# EAGLE design sum_rev1.4 (EAGLE 7.2.0)
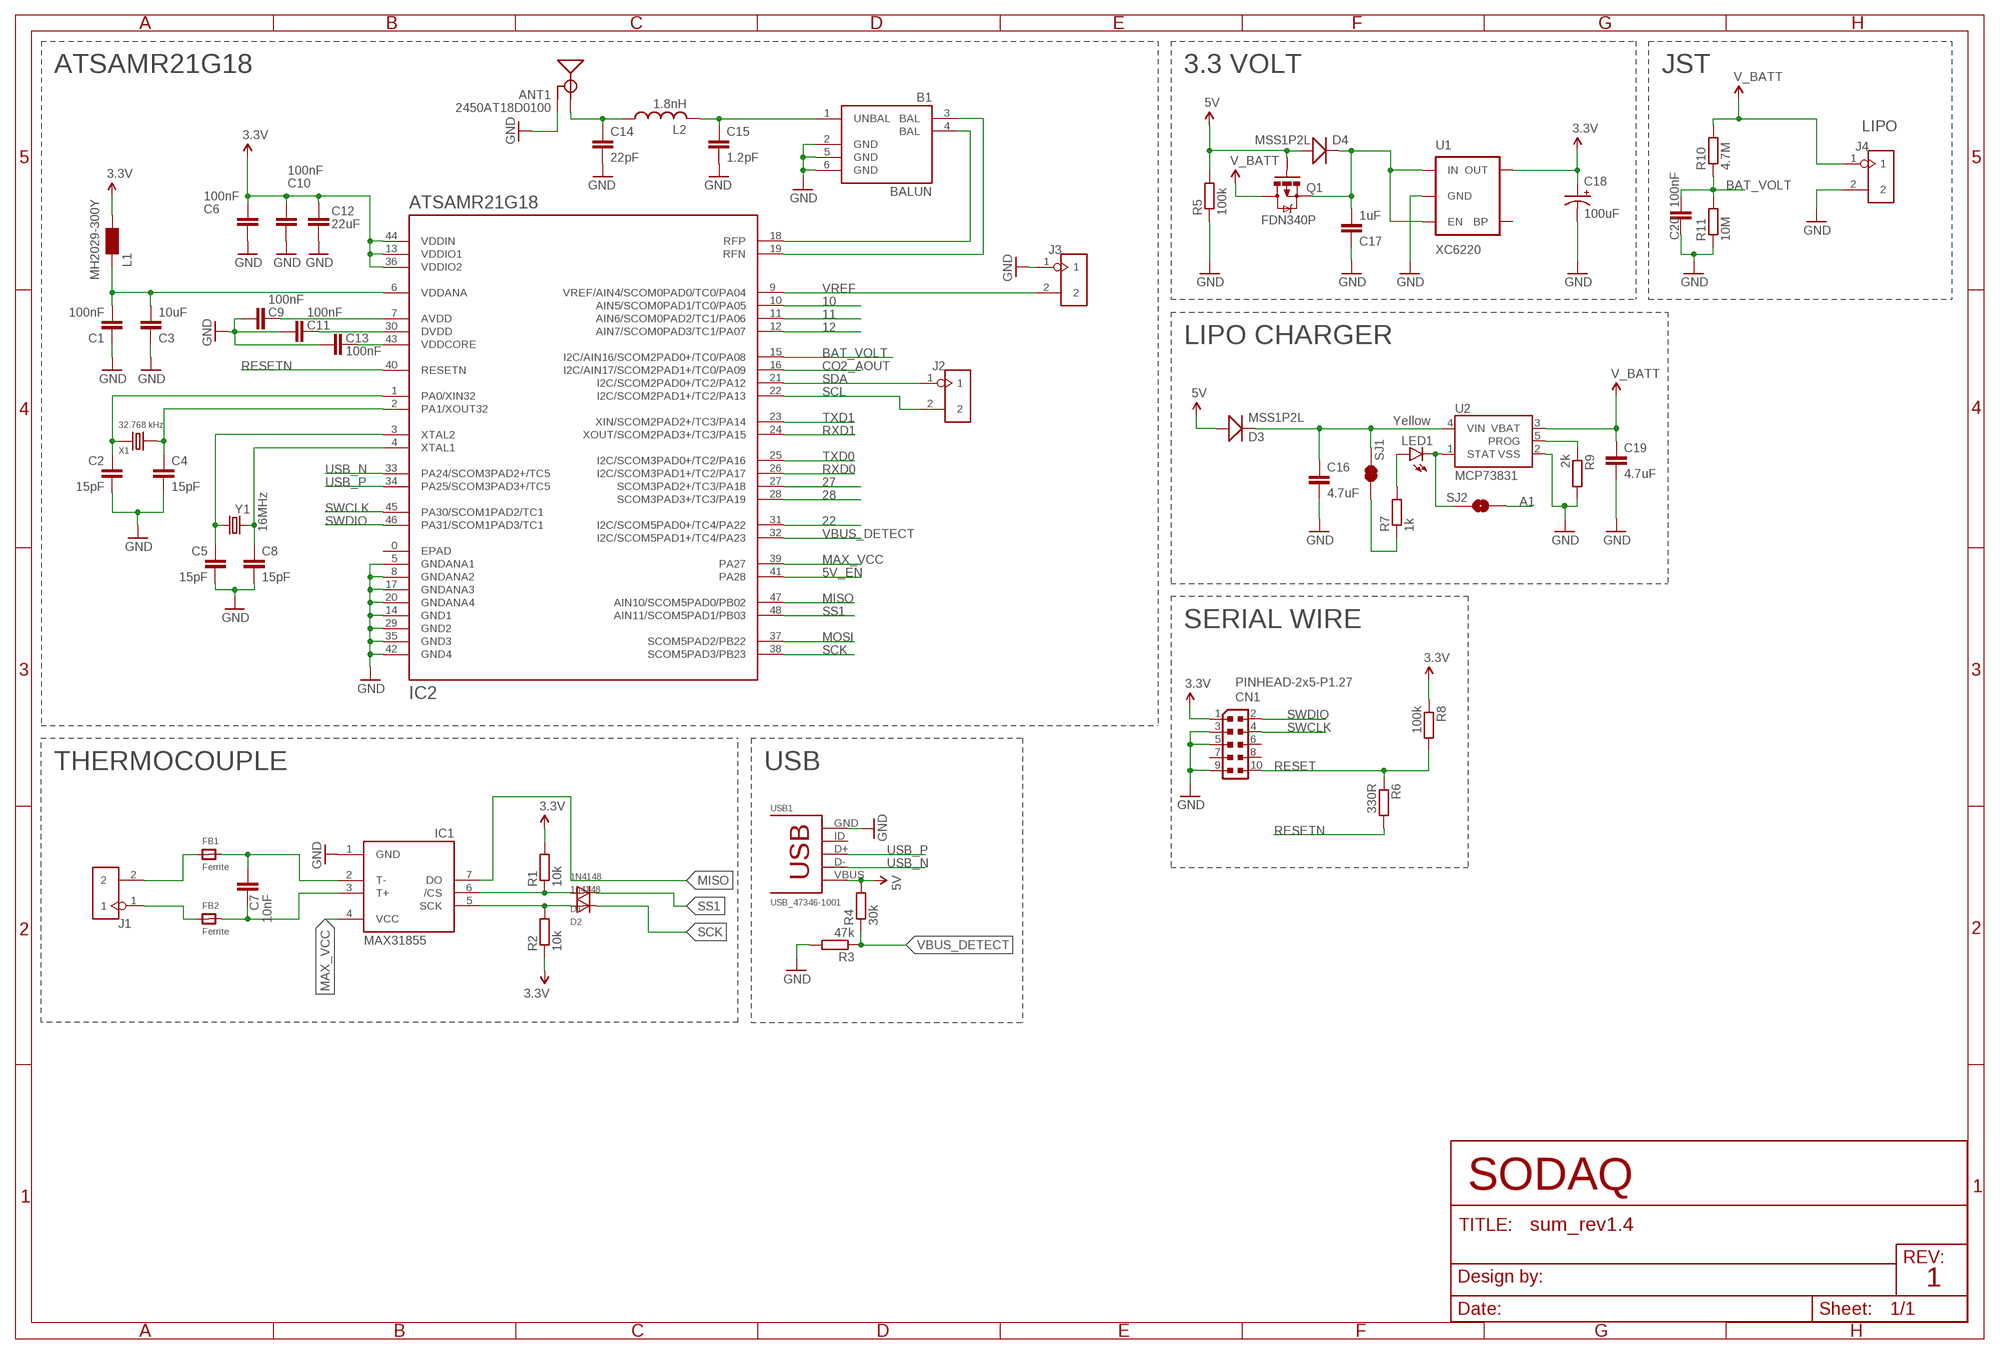
[diagram p0: schematic, sheet 1]

## Parts
ANT1  2450AT18D0100  [2450AT18D0100]
B1  BALUN  [BALUN]
C1  100nF  C_0402  [C0402]
C2  15pF  C_0402  [C0402]
C3  10uF  C_0402  [C0402]
C4  15pF  C_0402  [C0402]
C5  15pF  C_0402  [C0402]
C6  100nF  C_0402  [C0402]
C7  10nF  C_0402  [C0402]
C8  15pF  C_0402  [C0402]
C9  100nF  C_0402  [C0402]
C10  100nF  C_0402  [C0402]
C11  100nF  C_0402  [C0402]
C12  22uF  CAP0805  [0805]
C13  100nF  C_0402  [C0402]
C14  22pF  C_0402  [C0402]
C15  1.2pF  C_0402  [C0402]
C16  4.7uF  C_0603  [C0603]
C17  1uF  C_0603  [C0603]
C18  100uF  CAP_POL1206  [EIA3216]
C19  4.7uF  C_0603  [C0603]
C20  100nF  C_0402  [C0402]
CN1  PINHEAD-2x5-P1.27  0171_PH127-205DF055G00AROUND-PADS  [PINHEAD_2X05_127]
D1  1N4148  DIODESOD-323F  [SOD-323F]
D2  1n4148  DIODESOD-323F  [SOD-323F]
D3  MSS1P2L  D'1005'  [D1005]
D4  MSS1P2L  D'1005'  [D1005]
FB1  Ferrite  FERRITE_0805  [_0805]
FB2  Ferrite  FERRITE_0805  [_0805]
IC1  MAX31855  MAX6675  [SO08]
IC2  ATSAMR21G18  [QFN48_SMALL-CPAD]
J1  HEADER-2P-2.0  [2P-2.0]
J2  HEADER-2P-2.0  [2P-2.0]
J3  HEADER-2P-2.0  [2P-2.0]
J4  HEADER-2P-2.0  [2P-2.0]
L1  MH2029-300Y  0001_BLM21PG300SN1D_/_MH2029-300Y  [0805]
L2  1.8nH  L_0402  [L0402]
LED1  Yellow  LED0603  [LED-0603]
Q1  FDN340P  MOSFET-P-CHANNELSMALL  [SOT23-S-PADS]
R1  10k  R_0402  [R0402]
R2  10k  R_0402  [R0402]
R3  47k  R_0402  [R0402]
R4  30k  R_0402  [R0402]
R5  100k  R_0402  [R0402]
R6  330R  R_0402  [R0402]
R7  1k  R_0402  [R0402]
R8  100k  R_0402  [R0402]
R9  2k  R_0402  [R0402]
R10  4.7M  R_0402  [R0402]
R11  10M  R_0402  [R0402]
SJ1  SOLDERJUMPERNC2  [SJ_2S-NOTRACE]
SJ2  SOLDERJUMPERNO  [SJ_2S-NO]
U1  XC6220  V_REG_LDOSMD  [SOT23-5]
U2  MCP73831  [SOT23-5]
USB1  USB_47346-1001  [USB_47346-1001]
X1  32.768 kHz  CRYSTAL-3215  [2P-SMD-3.2X1.5]
Y1  16MHz  CRYSTAL5X3  [CRYSTAL-SMD-5X3]

## Nets
3.3V: C6.2 C10.2 C12.1 C18.A(+) CN1.1 IC2.13(VDDIO1) IC2.36(VDDIO2) IC2.44(VDDIN) L1.2 R1.2 R2.1 R8.1 U1.5(OUT)
5V: D3.+ D4.+ Q1.1(G) R4.2 R5.2 USB1.VBUS
5V_EN: IC2.41(PA28)
10: IC2.10(AIN5/SCOM0PAD1/TC0/PA05)
11: IC2.11(AIN6/SCOM0PAD2/TC1/PA06)
12: IC2.12(AIN7/SCOM0PAD3/TC1/PA07)
22: IC2.31(I2C/SCOM5PAD0+/TC4/PA22)
27: IC2.27(SCOM3PAD2+/TC3/PA18)
28: IC2.28(SCOM3PAD3+/TC3/PA19)
A1: SJ2.1
BAT_VOLT: C20.2 IC2.15(I2C/AIN16/SCOM2PAD0+/TC0/PA08) R10.1 R11.2
CO2_AOUT: IC2.16(I2C/AIN17/SCOM2PAD1+/TC0/PA09)
CS: D1.A IC1.6(/CS) R1.1
GND: ANT1.2(GND) ANT1.3(GND) ANT1.4(GND) B1.2(GND) B1.5(GND) B1.6(GND) C1.2 C2.1 C3.2 C4.2 C5.2 C6.1 C8.2 C9.2 C10.1 C11.2 C12.2 C13.2 C14.2 C15.2 C16.2 C17.1 C18.C(-) C19.2 C20.1 CN1.3 CN1.5 CN1.9 IC1.1(GND) IC2.5(GNDANA1) IC2.8(GNDANA2) IC2.14(GND1) IC2.17(GNDANA3) IC2.20(GNDANA4) IC2.29(GND2) IC2.35(GND3) IC2.42(GND4) J3.1 J4.2 R3.2 R5.1 R9.2 R11.1 U1.2(GND) U2.2(VSS) USB1.GND
LIPO_STAT: LED1.C SJ2.2 U2.1(STAT)
MAX_VCC: IC1.4(VCC) IC2.39(PA27)
MISO: IC1.7(DO) IC2.47(AIN10/SCOM5PAD0/PB02)
MOSI: IC2.37(SCOM5PAD2/PB22)
N$3: ANT1.1(SIGNAL) C14.1 L2.1
N$4: FB1.1 J1.2
N$5: C7.2 FB1.2 IC1.2(T-)
N$6: C13.1 IC2.43(VDDCORE)
N$7: B1.1(UNBAL) C15.1 L2.2
N$8: C11.1 IC2.30(DVDD)
N$9: FB2.1 J1.1
N$10: C9.1 IC2.7(AVDD)
N$11: C17.2 D4.- Q1.2(S) U1.1(IN) U1.3(EN)
N$12: C2.2 IC2.1(PA0/XIN32) X1.1
N$13: LED1.A R7.2
N$14: R9.1 U2.5(PROG)
N$15: C16.1 D3.- SJ1.2 U2.4(VIN)
N$16: R7.1 SJ1.1
N$17: C4.1 IC2.2(PA1/XOUT32) X1.2
N$18: C1.1 C3.1 IC2.6(VDDANA) L1.1
N$19: C5.1 IC2.3(XTAL2) Y1.1
N$20: C8.1 IC2.4(XTAL1) Y1.3
N$21: B1.4(BAL) IC2.18(RFP)
N$22: B1.3(BAL) IC2.19(RFN)
N$23: C7.1 FB2.2 IC1.3(T+)
RESET: CN1.10 R6.1 R8.2
RESETN: IC2.40(RESETN) R6.2
RXD0: IC2.26(I2C/SCOM3PAD1+/TC2/PA17)
RXD1: IC2.24(XOUT/SCOM2PAD3+/TC3/PA15)
SCK: D2.C IC2.38(SCOM5PAD3/PB23)
SCK1: D2.A IC1.5(SCK) R2.2
SCL: IC2.22(I2C/SCOM2PAD1+/TC2/PA13) J2.2
SDA: IC2.21(I2C/SCOM2PAD0+/TC2/PA12) J2.1
SS1: D1.C IC2.48(AIN11/SCOM5PAD1/PB03)
SWCLK: CN1.4 IC2.45(PA30/SCOM1PAD2/TC1)
SWDIO: CN1.2 IC2.46(PA31/SCOM1PAD3/TC1)
TXD0: IC2.25(I2C/SCOM3PAD0+/TC2/PA16)
TXD1: IC2.23(XIN/SCOM2PAD2+/TC3/PA14)
USB_N: IC2.33(PA24/SCOM3PAD2+/TC5) USB1.D-
USB_P: IC2.34(PA25/SCOM3PAD3+/TC5) USB1.D+
V_BATT: C19.1 J4.1 Q1.3(D) R10.2 U2.3(VBAT)
VBUS_DETECT: IC2.32(I2C/SCOM5PAD1+/TC4/PA23) R3.1 R4.1
VREF: IC2.9(VREF/AIN4/SCOM0PAD0/TC0/PA04) J3.2
Unconnected: CN1.6 CN1.7 CN1.8 U1.4(BP) USB1.ID

## Notes on the sheet
- 3.3 VOLT | JST
- ATSAMR21G18
- LIPO
- LIPO CHARGER
- SERIAL WIRE
- THERMOCOUPLE | USB
- SODAQ
- 1

## Power pins joined to a net without a drawn wire
EPAD: IC2.0(EPAD)

## Library data of the parts
ANT1 = gknff:2450AT18D0100
B1 = gknff:BALUN
C1-C11 C13-C17 C19 C20 = gknff:C
C12 = CH_passive:CAP: Capacitor Standard 0603 ceramic capacitor, and 0.1" leaded capacitor.
C18 = SparkFun-Capacitors:CAP_POL: Capacitor Polarized These are standard SMD and PTH capacitors. Normally 10uF, 47uF, and 100uF in electrolytic and tantalum varieties. Always verify the external diameter of the through hole cap, it varies with capacity, voltage, and manufacturer. The EIA devices should be standard.
CN1 = Connettori:0171_PH127-205DF055G00A: 2x5 PASSO 1,27
D1 D2 = adafruit:DIODE: Diode SMADIODE - SMA Surface Mount Package 20V 1A Schottky Diode Digikey: 641-1014-6-ND DO-1N4148 - Through Hole Small Current Diode SOD-123 20V 1 A (.5mV Vf) Schottky Diode - Digikey: MBRX120TPMSCT-ND SOD-323 10V 570mA (.38mV Vf, 3ns) Schottky Diode - Digikey: ZLLS410CT-ND SOD-523 30V 30mA Schottky Diode (RB751S-40TE61) - Digikey: RB751S-40TE61CT-ND SOT23-R/W - SOT23 Package (R = Solder Paste/Reflow Ovens, W = Hand-Soldering) BAT54Film 40V 300mA - Digikey: 497-7162-1-ND
D3 D4 = Seeedstudio_Discrete_2:D*
FB1 FB2 = microbuilder:FERRITE: Ferrite Bead 0603 MMZ1608B121C - 120 Ohm @ 100MHz, 600mA, 0.15 Ohm DC Resistance - Digikey: 445-2164-1-ND BK1608HW121-T - 120 Ohm, 600mA Ferrite Chip - Digikey: 587-1876-2-ND 0805 HZ0805B272R-10 - 2.7K Ohm @ 100MHz, 200mA, 0.8 Ohm DC Resistance - Digikey: 240-2504-1-ND (see also Murata BLM21BD272SN1L) MMZ2012Y152B - 1.5K Ohm @ 100MHz, 500mA, 0.4 Ohm DC Resistance - Digikey: 445-1560-1-ND - Mainly for high frequency (80-400MHz) MMZ2012R102A - 1K Ohm @ 100MHz, 500mA, 0.3 Ohm DC Resistance - Digikey: 445-1555-2-ND - More general purpose (10-200MHz)
IC1 = adafruit:MAX6675
IC2 = gknff:ATSAMR21G18
J1-J4 = Seeed_Connector:HEADER-2P
L1 = Protezione:0001_BLM21PG300SN1D_/_MH2029-300Y: BLM21; MONTHLY_USAGE: _____; PART_NUMBER: BLM21PG300SN1D_/_MH2029-300Y; PRICE: _____; SUPPLIER: _____; TYPE: Protezione
L2 = gknff:L
LED1 = SparkFun-LED:LED: LEDs Standard schematic elements and footprints for 5mm, 3mm, 1206, and 0603 sized LEDs. 5mm - Spark Fun Electronics SKU : COM-00529 (and others)
Q1 = gknff:MOSFET-P-CHANNEL
R1-R11 = gknff:R
SJ1 SJ2 = SparkFun-Passives:SOLDERJUMPER: Solder Jumper Standard SMD solder jumper. Used to automate production. Two varients : Normally Open and Normally Closed are the same, but have different paste layers. NC will have a large amount of paste and should jumper during reflow.
U1 = SparkFun-PowerIC:V_REG_LDO: Voltage Regulator LDO Standard 150mA LDO voltage regulator in SOT-23 layout. Micrel part MIC5205. BP (by-pass) pin is used to lower output noise with 470pF cap.
U2 = SparkFun-PowerIC:MCP73831: Miniature single cell, fully integrated Li-Ion, Li-polymer charge management controller http://ww1.microchip.com/downloads/en/DeviceDoc/21984a.pdf IC-09995; PROD_ID: IC-09995
USB1 = Itay_Dagan:USB_47346-1001
X1 = Seeed_Discrete:CRYSTAL*: CRYSTAL
Y1 = SparkFun-FreqCtrl:CRYSTAL: Various standard crystals. Proven footprints. Spark Fun Electronics SKU : COM-00534

## Net classes
2 gnd: width 0.254 mm, drill 0.254 mm, clearance 0.178 mm

## Board
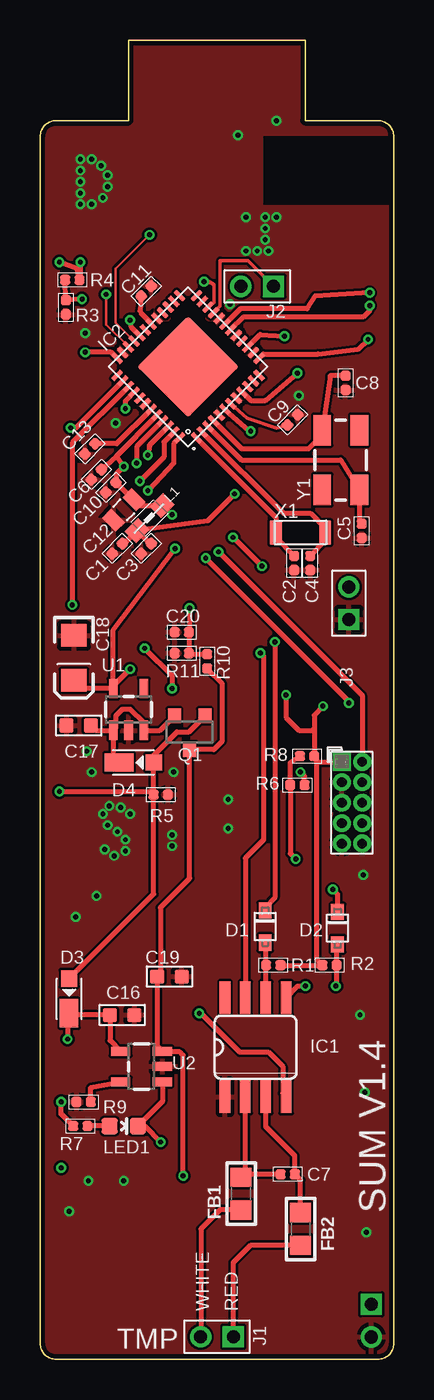
[diagram p1: board, top side]
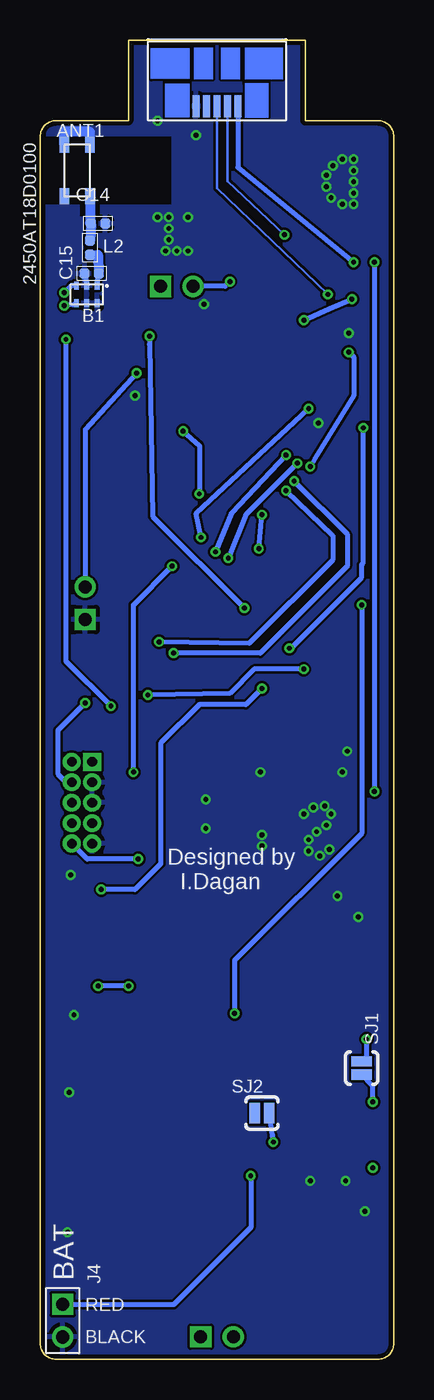
[diagram p2: board, bottom side, seen from below]

Size 22 x 82 mm. Coordinates in mm from the lower left corner, seen from the top.
Outline: 16.5,77 21,77 arc-90 22,76 22,1 arc-90 21,0 1,0 arc-90 0,1 0,76 arc-90 1,77 5.5,77 5.5,82 16.5,82 16.5,77
Copper layers (1*16): Top 0.035mm / dielectric 1.5mm / Bottom 0.035mm
Design rules "SeeedStudio_2layer_DRU_no_angle_20140221": minimum track width 6mil, minimum drill 12mil, track to track 6mil, track to pad 6mil, pad to pad 6mil, via to via 6mil, smd to smd 0mil, copper to edge 10mil, drill to drill 10mil, minimum pad ring 10mil, minimum via ring 6mil, stop-mask expansion 2mil, vias tented up to drill 100mil, thermal gap 10mil

### Footprints (pad centres in the part's own frame; a part is rotated, then mirrored left to right if it is on the bottom)
2450AT18D0100 = smd 1 x 0.6: 1 -1.6,-0.8; 2 1.6,-0.8; 3 1.6,0.8; 4 -1.6,0.8
BALUN = smd 0.3 x 0.5: 1 -0.65,-0.55; 2 0,-0.55; 3 0.65,-0.55; 4 0.65,0.55; 5 0,0.55; 6 -0.65,0.55
C0402 = smd 0.635 x 0.635: 1 -0.445,0; 2 0.445,0
0805 = smd 0.8 x 1.2: 1 -0.9,0; 2 0.9,0
C0603 = smd 0.889 x 0.889: 1 -0.762,0; 2 0.762,0
EIA3216 = smd 1.4 x 1.6: A 1.4,0; C -1.4,0
PINHEAD_2X05_127 = drill 0.6 pad 1.016 square: 1 -0.635,2.54 | drill 0.6 pad 1.016: 2 0.635,2.54; 3 -0.635,1.27; 4 0.635,1.27; 5 -0.635,0; 6 0.635,0; 7 -0.635,-1.27; 8 0.635,-1.27; 9 -0.635,-2.54; 10 0.635,-2.54
SOD-323F = smd 1 x 0.8: A -1,0; C 1,0
D1005 = smd 1.016 x 1.016: + -1.27,0 | smd 1.778 x 1.143: - 0.889,0
_0805 = smd 1.2 x 1.3: 1 -1.016,0; 2 1.016,0
SO08 = smd 0.66 x 2.032: 1 -1.905,-3.073; 2 -0.635,-3.073; 3 0.635,-3.073; 4 1.905,-3.073; 5 1.905,3.073; 6 0.635,3.073; 7 -0.635,3.073; 8 -1.905,3.073
QFN48_SMALL-CPAD = smd 4.5 x 4.5: 0 0,0 | smd 0.3 x 0.8: 1 -2.75,-3.5; 2 -2.25,-3.5; 3 -1.75,-3.5; 4 -1.25,-3.5; 5 -0.75,-3.5; 6 -0.25,-3.5; 7 0.25,-3.5; 8 0.75,-3.5; 9 1.25,-3.5; 10 1.75,-3.5; 11 2.25,-3.5; 12 2.75,-3.5; 25 2.75,3.5; 26 2.25,3.5; 27 1.75,3.5; 28 1.25,3.5; 29 0.75,3.5; 30 0.25,3.5; 31 -0.25,3.5; 32 -0.75,3.5; 33 -1.25,3.5; 34 -1.75,3.5; 35 -2.25,3.5; 36 -2.75,3.5 | smd 0.8 x 0.3: 13 3.5,-2.75; 14 3.5,-2.25; 15 3.5,-1.75; 16 3.5,-1.25; 17 3.5,-0.75; 18 3.5,-0.25; 19 3.5,0.25; 20 3.5,0.75; 21 3.5,1.25; 22 3.5,1.75; 23 3.5,2.25; 24 3.5,2.75; 37 -3.5,2.75; 38 -3.5,2.25; 39 -3.5,1.75; 40 -3.5,1.25; 41 -3.5,0.75; 42 -3.5,0.25; 43 -3.5,-0.25; 44 -3.5,-0.75; 45 -3.5,-1.25; 46 -3.5,-1.75; 47 -3.5,-2.25; 48 -3.5,-2.75
2P-2.0 = drill 0.813 pad 1.27 square: 1 -1.016,0 | drill 0.813 pad 1.27: 2 1.016,0
0805' = smd 1.2 x 1: 1 -1.1,0; 2 1.1,0
L0402 = smd 0.635 x 0.635: 1 -0.445,0; 2 0.445,0
LED-0603 = smd 1 x 1: A 0,-0.877; C 0,0.877
SOT23-S-PADS = smd 0.8 x 0.9: 1 -0.95,-1; 2 0.95,-1; 3 0,1.1
R0402 = smd 0.635 x 0.635: 1 -0.445,0; 2 0.445,0
SJ_2S-NOTRACE = smd 0.635 x 1.27: 1 -0.401,0; 2 0.413,0
SJ_2S-NO = smd 0.635 x 1.27: 1 -0.45,0; 2 0.45,0
SOT23-5 = smd 0.55 x 1.2: 1 -0.95,-1.3; 2 0,-1.3; 3 0.95,-1.3; 4 0.95,1.3; 5 -0.95,1.3
USB_47346-1001 = smd 1.38 x 0.45: D+ 2.66,0; D- 2.66,0.65; GND 2.66,-1.3; ID 2.66,-0.65; VBUS 2.66,1.3
2P-SMD-3.2X1.5 = smd 0.762 x 1.524: 1 -1.524,0; 2 1.524,0
CRYSTAL-SMD-5X3 = smd 1.9 x 1.1: 1 -1.85,-1.15; 2 1.85,-1.15; 3 1.85,1.15; 4 -1.85,1.15

### Placement (x,y rotation side)
ANT1  19.7,73.9 90 bottom
B1  19.1,66.2 180 bottom
C1  4.8,50.4 225 top
C2  15.8,49.5 90 top
C3  6.6,50.4 225 top
C4  16.8,49.5 270 top
C5  20,51.5 270 top
C6  3.5,55 45 top
C7  15.4,11.5 180 top
C8  19,60.7 270 top
C9  15.7,58.4 45 top
C10  4.4,54.2 45 top
C11  6.6,66.4 45 top
C12  5.2,52.8 225 top
C13  3.1,56.6 225 top
C14  18.4,70.6 0 bottom
C15  18.8,67.5 180 bottom
C16  5.1,21.4 0 top
C17  2.4,39.4 0 top
C18  2.1,43.6 270 top
C19  8.04,23.79 0 top
C20  8.81,45.2 0 top
CN1  19.4,34.6 0 top
D1  14,26.9 90 top
D2  18.5,26.8 90 top
D3  1.8,22.4 270 top
D4  5.8,37.1 180 top
FB1  12.5,10.3 90 top
FB2  16.2,8.1 90 top
IC1  13.4,19.4 0 top
IC2  9.2,61.7 45 top
J1  11,1.4 180 top
J2  13.5,66.7 180 top
J3  19.2,47 90 top
J4  20.6,2.4 270 bottom
L1  MH2029-300Y  [0805']  6.8,52.3 45 top
L2  18.9,69.1 270 bottom
LED1  5.2,14.5 270 top
Q1  9.3,39 180 top
R1  14.5,24.5 0 top
R2  18,24.5 0 top
R3  1.6,65.4 270 top
R4  2,67.1 0 top
R5  7.5,35.1 180 top
R6  16,35.7 0 top
R7  2.5,14.5 0 top
R8  16.6,37.5 180 top
R9  2.7,16 180 top
R10  10.39,43.39 270 top
R11  8.81,43.89 0 top
SJ1  2,18.1 90 bottom
SJ2  8.2,15.3 0 bottom
U1  5.5,40.4 0 top
U2  6.3,18.2 90 top
USB1  11,80.55 270 bottom
X1  16.2,51.4 0 top
Y1  18.7,55.9 90 top

### Tracks (layer width: path | path; a pad name or v marks a point on that pad's centre or on a via)
3.3V  (via drill 0.3)
  Top 0.305: R1.2 R2.1 17.2,24.86 17.2,37.15 | U1.5 2.6,41.7 C18.A | 17.2,37.15 R8.1 17.04,39.2 | 17.2,37.15 CN1.1 | U1.5 4.55,45.35 v8.4,50.4 | v8.2,52.5 8.06,52.6 L1.2 6.2,53.08 C12.1 5.79,53.44 C10.2 4.71,55.01 v5.2,55.5 4.75,56.15 | U1.5 4.55,41.85 v5.6,42.9 | C6.2 4.75,56.15 | 4.75,56.15 7.25,58.66 IC2.44 | IC2.36 4.41,62.6 v2.8,62.6 | IC2.13 13.89,62.5 17.3,62.5 19.8,62.8 v20.4,63.4 | v17.6,40.6 17.04,40.04 17.04,39.2 | v15.3,41.3 15.3,39.9 16.1,39.1 16.95,39.1 17.04,39.2
  Bottom 0.305: v8.4,50.4 v8.2,52.5 | v5.6,42.9 8.7,42.9 10.2,41.4 v15.3,41.3 | v2.8,62.6 2.5,62.3 2.5,59.9 4.9,56 v5.2,55.5 | v20.4,63.4 20.4,43.4 v17.6,40.6
5V  (via drill 0.3)
  Top 0.305: Q1.1 9.25,39 8.5,39 7.07,37.57 D4.+ 7.06,37.09 R5.2 | R5.2 7.06,28.93 D3.+ | v2.5,68.2 2.5,67.16 R4.2 2.3,67.8 v1.2,68.2 | v1.2,35.3 6.86,35.3 R5.2
  Bottom 0.305: USB1.VBUS 9.7,74.1 v2.5,68.2 | v1.2,68.2 v1.2,35.3
BAT_VOLT  (via drill 0.3)
  Top 0.305: IC2.15 13.68,63.7 v15.2,63.6 | v9.3,46.7 9.3,45.24 C20.2 R11.2 9.31,43.83 R10.1
  Bottom 0.305: v15.2,63.6 15.2,63.1 15,52.4 v9.3,46.7
CS
  Top 0.305: IC1.6 14.06,22.49 R1.1 14.06,25.84 D1.A
GND  (via drill 0.3, 0.3 pad 0.3)
  Bottom 0.305: C15.2 19.14,67 B1.2
  Bottom 0.61: ANT1.2 18.9,76.3 20.5,76.3 ANT1.3
  other vias: 2.9,37.8 20.1,30.1 14.7,77 2.5,74.6 16.1,59.9 4.7,58.2 2.8,63.8 12.8,71 14,71 14.7,71 14,70.3 14,69.6 13.5,68.9 12.8,68.9 14.2,68.9 2.5,73.9 2.5,73.2 2.5,72.5 3.2,71.8 4.2,72.9 4.2,73.6 3.8,74.2 3.2,74.6 2.5,71.8 3.9,72.2 8.2,32.6 8.2,31.9 8.3,36.5 3.2,36.5 5.6,33.9 5,34.3 4.3,34.4 3.9,33.9 4.2,33.2 4.8,32.8 5.3,32.3 5.3,31.6 4.6,31.3 4,31.7 11.8,65.6 3.5,28.8 2.2,27.5 11.7,34.8 11.7,33 19.9,21.4 20.2,16.6 5.2,11.1 3,11.1 20.3,7.9 1.8,9.2 12.3,76.1
  pour Top: 23.5,-2 -3.5,-2 -3.5,83 23.5,83
  pour Bottom: 25.5,-3 -5.5,-3 -5.5,85 25.5,85
  pour Bottom (no thermals): 18.2,76.4 19.5,76.4 19.5,76 18.2,76
  pour Bottom (no thermals): 20.1,76.3 20.1,76 21.2,76 21.2,76.3
  pour Bottom (no thermals): 19.8,71.8 21.2,71.8 21.2,71.5 19.8,71.5
LIPO_STAT  (via drill 0.3)
  Top 0.305: v7.5,13.5 6.5,14.5 LED1.C 7.6,16.02 U2.1
  Bottom 0.305: v7.5,13.5 7.55,13.95 SJ2.2
MAX_VCC  (via drill 0.3)
  Top 0.305: IC2.39 2,56.98 v2,46.9 | v9.9,21.5 10,21.5 12.4,19.1 14.2,19.1 15.1,18.2 15.1,16.53 IC1.4
  Bottom 0.305: v2,46.9 2,32.7 9.9,24.8 v9.9,21.5
MISO  (via drill 0.3)
  Top 0.305: IC2.47 7.7,57.02 7.7,56.1 v6.2,54.6 | v13.7,43.9 13.9,43.7 13.9,32.3 12.77,31.16 IC1.7
  Bottom 0.305: v6.2,54.6 2.9,51.3 2.9,49.3 8.3,43.9 v13.7,43.9
N$1
  cutout Top: 21.7,76 13.9,76 13.9,71.8 21.7,71.8
N$2
  cutout Bottom: 22,76 20.8,76 20.8,75.9 20.2,75.9 20.2,76 19.2,76 19.2,75.9 18.6,75.9 18.6,76 13.9,76 13.9,71.8 20.2,71.8 20.2,72 20.8,72 20.8,71.8 22,71.8
N$3
  Bottom 0.61: ANT1.1 18.9,70.64 C14.1 18.84,70.59 L2.1
N$4
  Top 0.305: FB1.1 11.18,9.28 10,8.1 10,1.42 J1.2
N$5
  Top 0.305: IC1.2 12.77,11.55 FB1.2 12.68,11.5 C7.2
N$6
  Top 0.305: IC2.43 4.77,56.91 C13.1
N$7
  Bottom 0.305: 18.36,67.56 C15.1 18.35,67.59 B1.1
  Bottom 0.61: L2.2 18.4,68.64 C15.1
N$8
  Top 0.305: C11.1 6.2,65.17 6.3,65 6.9,64.4 IC2.30
N$9
  Top 0.305: FB2.1 13.08,7.08 12,6 12,1.42 J1.1
N$10
  Top 0.203: IC2.7 12.85,58.5 14.7,57.9 C9.1
N$11
  Top 0.305: C17.2 3.46,39.1 U1.1 | U1.1 4.55,37.46 D4.- | Q1.2 7.45,39.1 U1.3 6.45,39.55 5.6,40.4 5.1,40.4 4.7,40 4.7,39.25 U1.1
N$12
  Top 0.305: IC2.1 14.68,52.34 X1.1 14.68,51.07 C2.2
N$13
  Top 0.305: LED1.A R7.2
N$14
  Top 0.305: R9.1 3.14,16.89 U2.5
N$15  (via drill 0.3)
  Top 0.305: 1.71,21.4 C16.1 4.34,19.81 U2.4 | 1.71,21.4 D3.- | 1.71,21.4 1.71,19.91 v1.7,19.9
  Bottom 0.305: v1.7,19.9 1.7,18.81 SJ1.2
N$16  (via drill 0.3)
  Top 0.305: R7.1 1.3,15.26 v1.3,16
  Bottom 0.305: v1.3,16 1.3,17 SJ1.1
N$17
  Top 0.305: IC2.2 15.12,52.6 16.8,52.6 17.72,51.68 X1.2 17.72,50.87 C4.1
N$18  (via drill 0.3)
  Top 0.305: IC2.6 13,57.75 v13.1,57.7 | v12.1,53.8 10.42,52.12 L1.1 | L1.1 6.83,50.71 C3.1 | L1.1 5.21,50.71 C1.1
  Bottom 0.305: v13.1,57.7 12.1,56.8 v12.1,53.8
N$19
  Top 0.305: IC2.3 12.53,55.9 18.7,55.9 Y1.1 19.85,52.09 C5.1
N$20
  Top 0.305: C8.1 18.04,61.15 Y1.3 17.55,57.45 16.7,56.6 12.53,56.6 IC2.4
N$21  (via drill 0.3)
  Top 0.305: IC2.18 12.65,64.8 20.1,64.8 20.5,65.2 v20.5,65.5
  Bottom 0.305: B1.4 19.95,65.55 v20.5,65.5
N$22  (via drill 0.3)
  Top 0.305: v20.5,66.3 17.1,66.1 16.6,65.3 12.45,65.3 IC2.19
  Bottom 0.305: B1.3 20.05,66.75 v20.5,66.3
N$23
  Top 0.305: IC1.3 14.04,14.46 15.85,12.65 C7.1 16.2,11.14 FB2.2
N$24  (via drill 0.3)
  other vias: 1.3,11.9
N$25
  cutout Bottom: 18.6,71.8 18.6,71.1 18.3,71.1 18.3,71.8
N$26
  cutout Bottom: 19.2,71.8 19.5,71.8 19.5,71.1 19.2,71.1
RESET  (via drill 0.3)
  Top 0.305: v15.9,31.1 15.56,31.45 R6.1 15.56,37.1 R8.2
  Bottom 0.305: v15.9,31.1 19.07,31.1 CN1.10
RESETN  (via drill 0.3)
  Top 0.305: R6.2 16.45,36.26 v16.2,36.5 | v13.8,49.3 v12,51.1 | v5.3,59.1 5.3,59.57 IC2.40
  Bottom 0.305: v16.2,36.5 16.2,46.9 v13.8,49.3 | v12,51.1 12.3,52.6 v5.3,59.1
SCK  (via drill 0.3)
  Top 0.305: v6.5,44.2 8.2,42.5 v8.2,41.7 | v18.2,29.2 18.5,28.9 D2.C | v1.9,57.9 2.22,57.9 IC2.38
  Bottom 0.305: v6.5,44.2 6.4,44.2 2,48.6 2,49.4 1.9,49.5 v1.9,57.9 | v8.2,41.7 9.2,40.7 12.1,40.7 14.5,38.3 14.5,30.8 16.1,29.2 v18.2,29.2
SCK1  (via drill 0.3)
  Top 0.305: D2.A 18.45,25.74 R2.2 18.45,23.24 v18.4,23.2 | IC1.5 16.03,23.2 v16.5,23.2
  Bottom 0.305: v16.5,23.2 v18.4,23.2
SCL  (via drill 0.3)
  Top 0.203: IC2.22 10.8,65.67 10.8,66.8 10.5,67 v10.2,67
  Bottom 0.305: v10.2,67 10.5,66.7 J2.2
SDA
  Top 0.203: IC2.21 11.2,65.47 11.2,68.3 12.92,68.3 J2.1
SS1  (via drill 0.3)
  Top 0.305: IC2.48 8.3,56.91 8.3,55.7 v6.7,54 | v14.6,44.6 14.6,28.7 14,28.1 D1.C
  Bottom 0.305: v6.7,54 3.8,51.2 3.8,49.7 9,44.5 v14.6,44.6
SWCLK  (via drill 0.3)
  Top 0.305: IC2.45 6,56.73 v6,55.7 | v10.3,49.8 19.2,40.9 v19.2,40.8
  Bottom 0.305: v6,55.7 9.2,52.5 v10.3,49.8 | v19.2,40.8 20.9,39.1 20.9,36.4 20.37,35.87 CN1.4
SWDIO  (via drill 0.3)
  Top 0.305: v11.1,50.2 20.04,41.27 CN1.2 | IC2.46 6.8,56.83 v6.7,56.2
  Bottom 0.305: v6.7,56.2 10.1,52.6 v11.1,50.2
USB_N  (via drill 0.3)
  Top 0.152: v6.8,69.9 4.7,67.8 4.7,64.43 IC2.33
  Bottom 0.152: USB1.D- 10.35,73.25 v6.8,69.9
USB_P  (via drill 0.3)
  Top 0.152: v4.1,66.2 4.1,64.33 IC2.34
  Bottom 0.152: USB1.D+ 11,72.8 v4.1,66.2
V_BATT  (via drill 0.3)
  Top 0.305: R10.2 11.3,42.03 11.3,38.4 10.8,37.9 Q1.3 9.3,29.9 7.48,28.08 7.48,23.99 C19.1 7.28,19.47 U2.3 7.65,19.1 8.7,19.1 8.9,18.9 v8.9,11.4
  Bottom 0.305: v8.9,11.4 8.9,8.2 13.7,3.4 20.58,3.4 J4.1
VBUS_DETECT  (via drill 0.3)
  Top 0.305: IC2.32 5.7,64.14 v5.6,64.6 | v2.6,65.9 R3.1 R4.1
  Bottom 0.305: v5.6,64.6 4,65.3 v2.6,65.9
VREF  (via drill 0.3)
  Top 0.305: IC2.9 12.59,60.11 13.1,59.6 14,59.6 v16,61.3
  Bottom 0.305: v16,61.3 19.2,57.8 J3.2

### Text on the board
tNames: SUM V1.4 | WHITE | RED | TMP
bNames: Designed by / I.Dagan | BAT | RED | BLACK
Reference: no components | no components